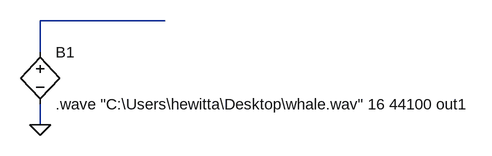
[diagram p0: schematic Draft1.asc]
Draft1.asc, the LTspice schematic file:
Version 4
SHEET 1 880 680
WIRE 272 80 80 80
WIRE 80 128 80 80
WIRE 80 240 80 208
FLAG 80 240 0
SYMBOL bv 80 112 R0
SYMATTR InstName B1
SYMATTR Value .wave "C:\Users\hewitta\Desktop\whale.wav" 16 44100 out1

The netlist it stands for:
* Draft1.asc
B1 N001 0 .wave "C:\Users\hewitta\Desktop\whale.wav" 16 44100 out1
.backanno
.end